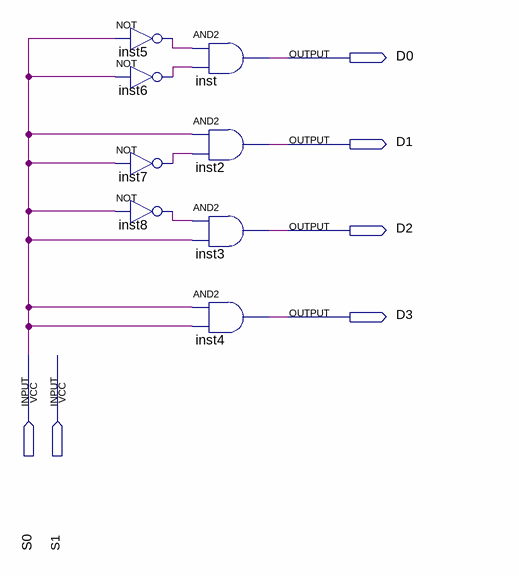
[diagram p0: schematic sheet]
// Quartus schematic 2to4decoder.bdf as structural Verilog: 8 symbols, 6 pins
module \2to4decoder  (
  input  S0,
  input  S1,
  output D0,
  output D1,
  output D2,
  output D3
);

  wire inst5_out, inst6_out, inst7_out, inst8_out;

  not inst5 (inst5_out, S0);
  not inst6 (inst6_out, S0);
  not inst7 (inst7_out, S0);
  not inst8 (inst8_out, S0);
  and inst (D0, inst5_out, inst6_out);
  and inst2 (D1, S0, inst7_out);
  and inst3 (D2, inst8_out, S0);
  and inst4 (D3, S0, S0);
endmodule
